# Altium schematic sheet OpenMV电阻屏扩展板.SchDoc
size A4
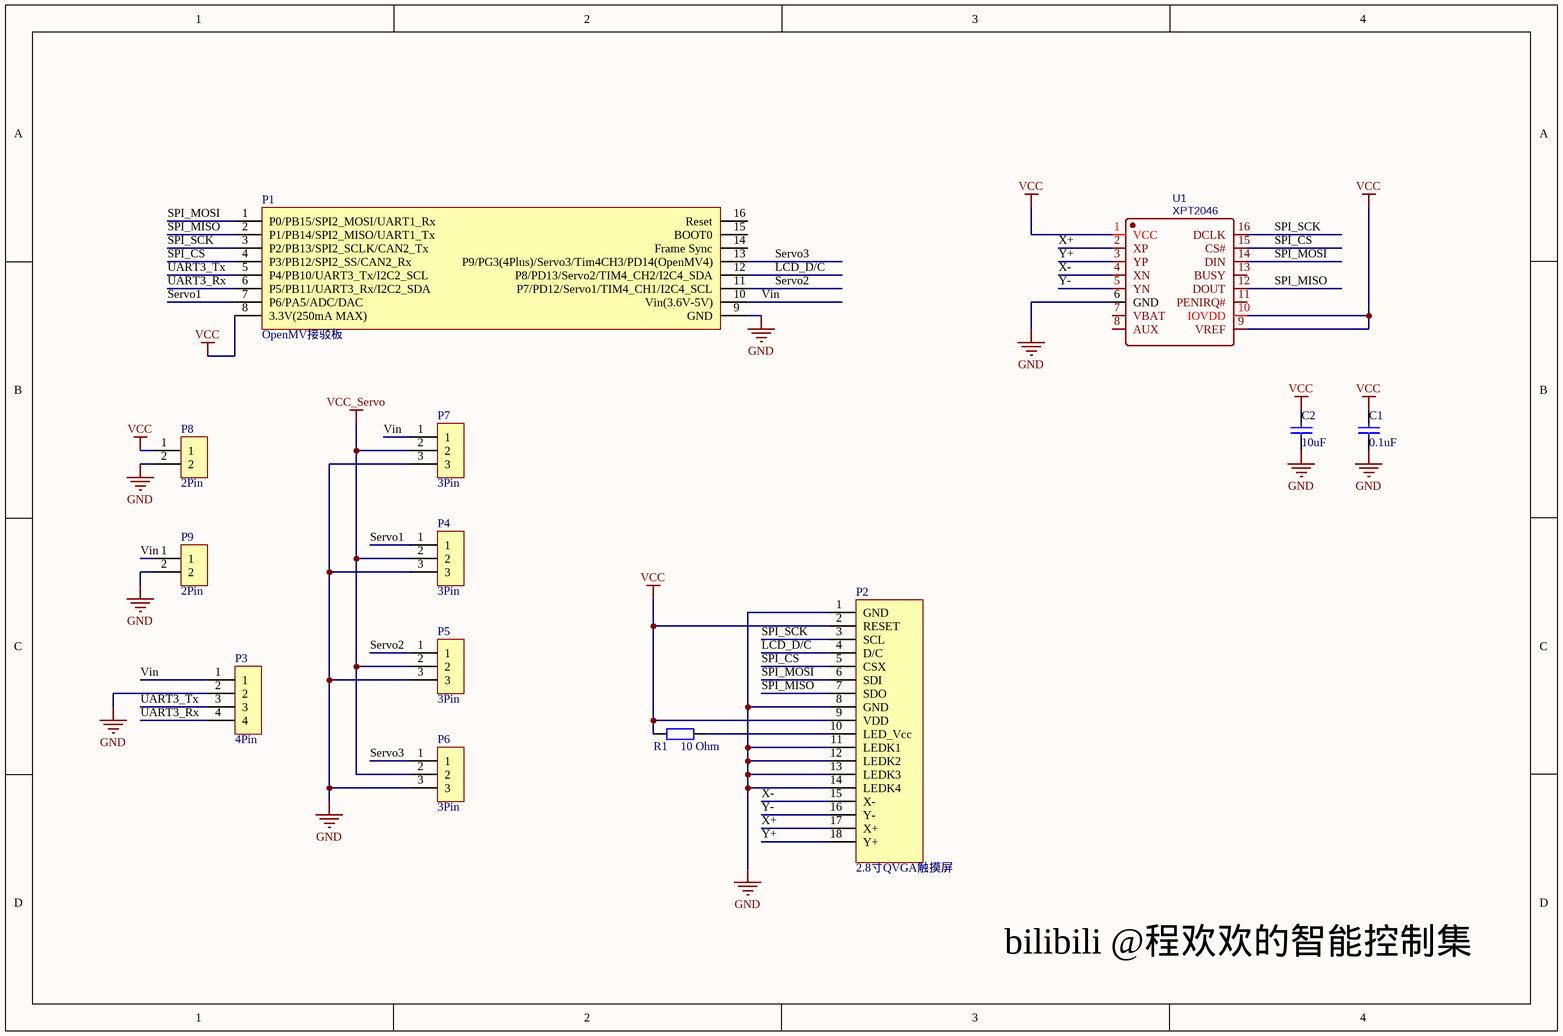
[diagram p0: OpenMV电阻屏扩展板.SchDoc]

## Parts
C1  0.1uF  [0603]
C2  10uF  [0805]
P1  OpenMV接驳板  [OpenMV扩展版(贴片排母)]
P2  2.8寸QVGA触摸屏  [2.8寸电阻屏-修改版]
P3  4Pin  [4Pin-2.54]
P4  3Pin  [3Pin-2.54]
P5  3Pin  [3Pin-2.54]
P6  3Pin  [3Pin-2.54]
P7  3Pin  [3Pin-2.54]
P8  2Pin  [2Pin-2.54]
P9  2Pin  [2Pin-2.54]
R1  10 Ohm  [0603]
U1  XPT2046  [TSSOP-16_L5.0]

## Nets
GND: C1.1 C2.1 P1.9(GND) P2.1(GND) P2.8(GND) P2.11(LEDK1) P2.12(LEDK2) P2.13(LEDK3) P2.14(LEDK4) P3.2 P4.3 P5.3 P6.3 P7.3 P8.2 P9.2 U1.6(GND)
VCC: C1.2 C2.2 P1.8(3.3V(250mA_MAX)) P2.2(RESET) P2.9(VDD) P8.1 R1.1 U1.1(VCC) U1.9(VREF) U1.10(IOVDD)
VCC_Servo: P4.2 P5.2 P6.2 P7.2
LCD_D/C: P1.12(P8/PD13/Servo2/TIM4_CH2/I2C4_SDA) P2.4(D/C)
Servo1: P1.7(P6/PA5/ADC/DAC) P4.1
Servo2: P1.11(P7/PD12/Servo1/TIM4_CH1/I2C4_SCL) P5.1
Servo3: P1.13(P9/PG3(4Plus)/Servo3/Tim4CH3/PD14(OpenMV4)) P6.1
SPI_CS: P1.4(P3/PB12/SPI2_SS/CAN2_Rx) P2.5(CSX) U1.15(CS#)
SPI_MISO: P1.2(P1/PB14/SPI2_MISO/UART1_Tx) P2.7(SDO) U1.12(DOUT)
SPI_MOSI: P1.1(P0/PB15/SPI2_MOSI/UART1_Rx) P2.6(SDI) U1.14(DIN)
SPI_SCK: P1.3(P2/PB13/SPI2_SCLK/CAN2_Tx) P2.3(SCL) U1.16(DCLK)
UART3_Rx: P1.6(P5/PB11/UART3_Rx/I2C2_SDA) P3.4
UART3_Tx: P1.5(P4/PB10/UART3_Tx/I2C2_SCL) P3.3
Vin: P1.10(Vin(3.6V-5V)) P3.1 P7.1 P9.1
X+: P2.17(X+) U1.2(XP)
X-: P2.15(X-) U1.4(XN)
Y+: P2.18(Y+) U1.3(YP)
Y-: P2.16(Y-) U1.5(YN)
NetP2_10: P2.10(LED_Vcc) R1.2

Not connected (* = marked no-connect by the designer): P1 14(Frame_Sync) 15(BOOT0) 16(Reset); U1 7(VBAT) 8(AUX) 11(PENIRQ#) 13(BUSY)

## Notes on the sheet
- bilibili @程欢欢的智能控制集

## Library data of the parts
C1 C2 = Cap: Capacitor; Published: 8-Jun-2000; LatestRevisionDate: 17-Jul-2002; LatestRevisionNote: Re-released for DXP Platform.; PackageReference: RAD-0.3; Publisher: Altium Limited; PackageDescription: Radial Cap, Thru-Hole; 2 Leads; 0.3 in Pin Spacing
R1 = Res2: Resistor; Value: 200Ω; Published: 8-Jun-2000; LatestRevisionDate: 17-Jul-2002; LatestRevisionNote: Re-released for DXP Platform.; PackageReference: AXIAL-0.4; Publisher: Altium Limited
U1 = XPT2046: BOM_Manufacturer: XPT; BOM_Supplier: LCSC; BOM_Manufacturer Part: XPT2046; BOM_Supplier Part: C19076; BOM_JLCPCB Part Class: Extended Part; spicePre: U; spiceSymbolName: XPT2046